# EAGLE schematic vetinari-H-bridge (EAGLE 6.3)
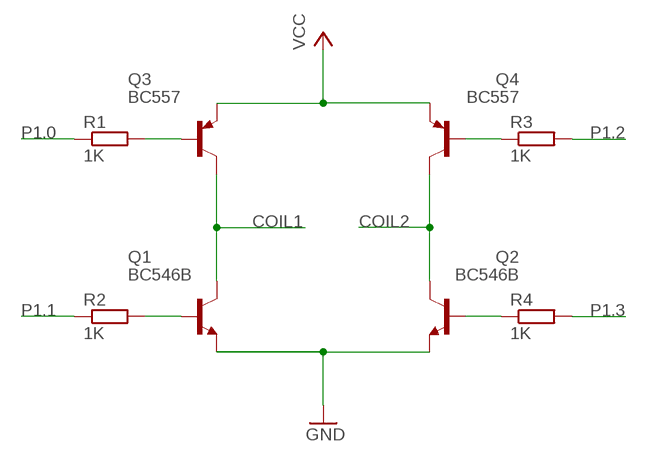
[diagram p0: schematic, sheet 1]

## Parts
Q1  BC546B  [TO92-EBC]
Q2  BC546B  [TO92-EBC]
Q3  BC557  [TO92-EBC]
Q4  BC557  [TO92-EBC]
R1  1K  R-EU_0207/7  [0207/7]
R2  1K  R-EU_0207/7  [0207/7]
R3  1K  R-EU_0207/7  [0207/7]
R4  1K  R-EU_0207/7  [0207/7]

## Nets
COIL1: Q1.C Q3.C
COIL2: Q2.C Q4.C
GND: Q1.E Q2.E
N$4: Q3.B R1.2
N$5: Q1.B R2.2
N$6: Q4.B R3.1
N$7: R4.1
P1.0: R1.1
P1.1: R2.1
P1.2: R3.2
P1.3: R4.2
VCC: Q3.E Q4.E
Unconnected: Q2.B

## Library data of the parts
Q1 Q2 = transistor-npn:BC546*: NPN Transistor
Q3 Q4 = transistor-pnp:BC557*: PNP Transistror
R1-R4 = rcl:R-EU_: RESISTOR, European symbol